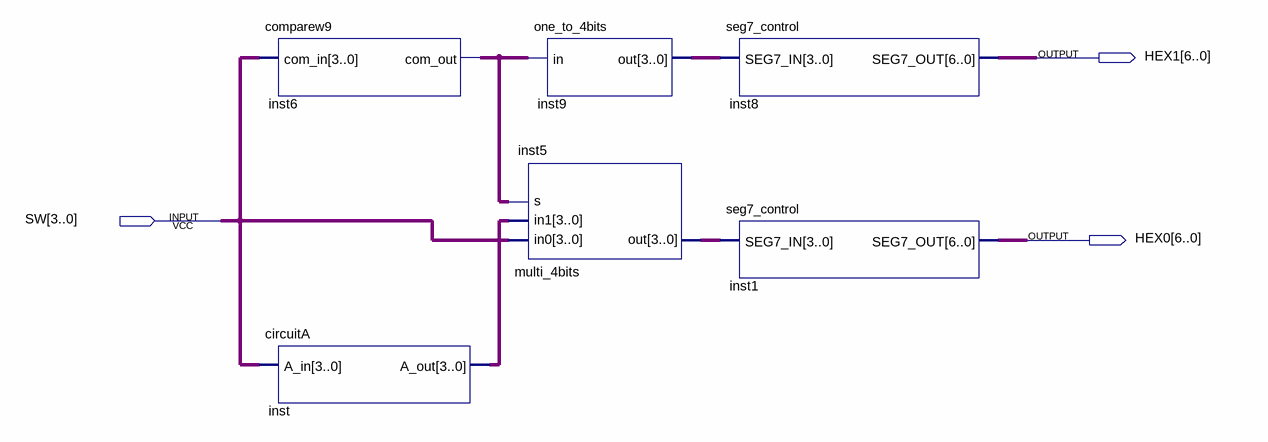
[diagram p0: schematic sheet]
// Quartus schematic part2_sch.bdf as structural Verilog: 6 symbols, 3 pins
module part2_sch (
  input  [3:0] SW,
  output [6:0] HEX1,
  output [6:0] HEX0
);

  wire inst6_com_out;
  wire [3:0] inst5_out, inst9_out, inst_a_out;

  comparew9 inst6 (.com_in(SW), .com_out(inst6_com_out));
  circuitA inst (.A_in(SW), .A_out(inst_a_out));
  one_to_4bits inst9 (.in(inst6_com_out), .out(inst9_out));
  multi_4bits inst5 (.in0(SW), .in1(inst_a_out), .s(inst6_com_out), .out(inst5_out));
  seg7_control inst8 (.SEG7_IN(inst9_out), .SEG7_OUT(HEX1));
  seg7_control inst1 (.SEG7_IN(inst5_out), .SEG7_OUT(HEX0));
endmodule
